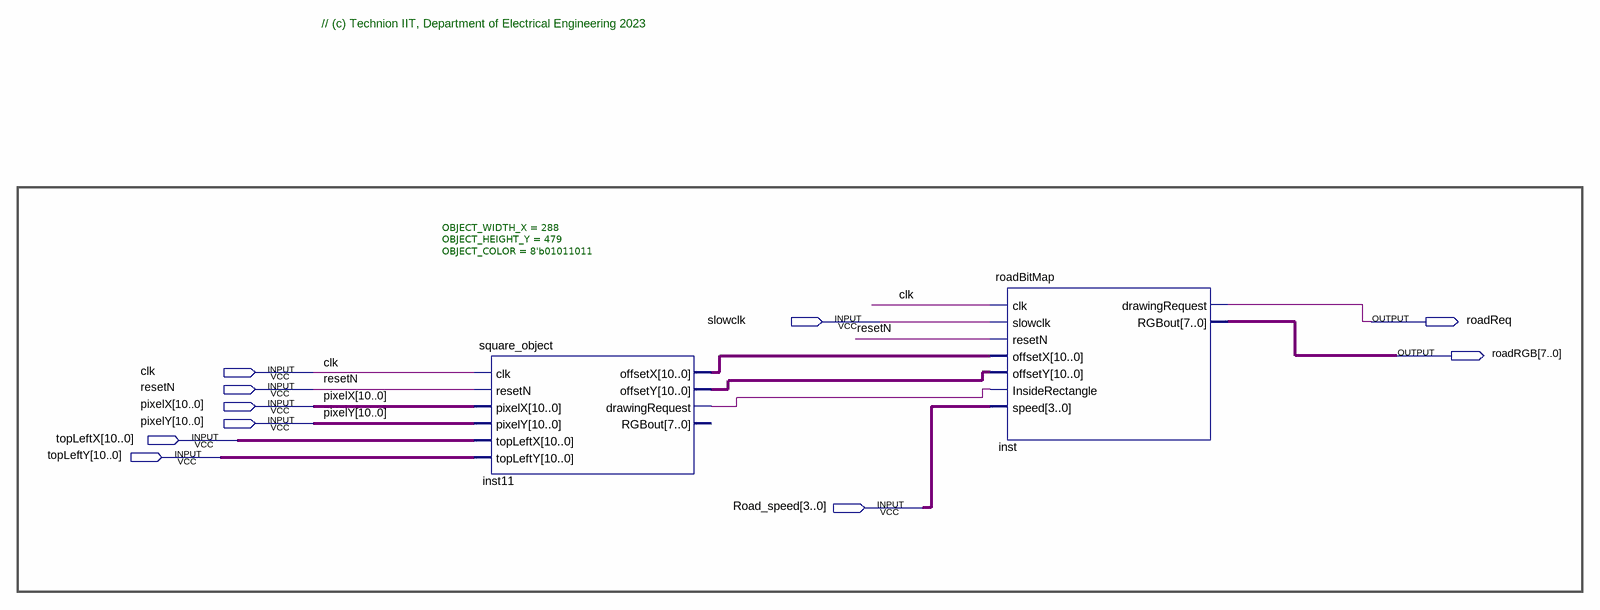
[diagram p0: schematic sheet]
// Quartus schematic roadBlock.bdf as structural Verilog: 2 symbols, 10 pins
module roadBlock (
  input  slowclk,
  input  clk,
  input  resetN,
  input  [10:0] pixelX,
  input  [10:0] pixelY,
  input  [10:0] topLeftX,
  input  [10:0] topLeftY,
  input  [3:0] Road_speed,
  output roadReq,
  output [7:0] roadRGB
);

  wire inst11_drawingrequest;
  wire [10:0] inst11_offsetx, inst11_offsety;

  square_object #(.OBJECT_WIDTH_X(288), .OBJECT_HEIGHT_Y(479), .OBJECT_COLOR(8'b01011011)) inst11 (
    .clk(clk), .resetN(resetN), .pixelX(pixelX), .pixelY(pixelY), .topLeftX(topLeftX), .topLeftY(topLeftY),
    .offsetX(inst11_offsetx), .offsetY(inst11_offsety), .drawingRequest(inst11_drawingrequest));  // open: RGBout
  roadBitMap inst (
    .clk(clk), .slowclk(slowclk), .resetN(resetN), .offsetX(inst11_offsetx), .offsetY(inst11_offsety),
    .InsideRectangle(inst11_drawingrequest), .speed(Road_speed), .drawingRequest(roadReq), .RGBout(roadRGB));

  // Notes on the sheet:
  //   // (c) Technion IIT, Department of Electrical Engineering 2023
endmodule
